# Altium schematic sheet ADC.SchDoc
size A4; SheetNumber: 7; SheetTotal: 9
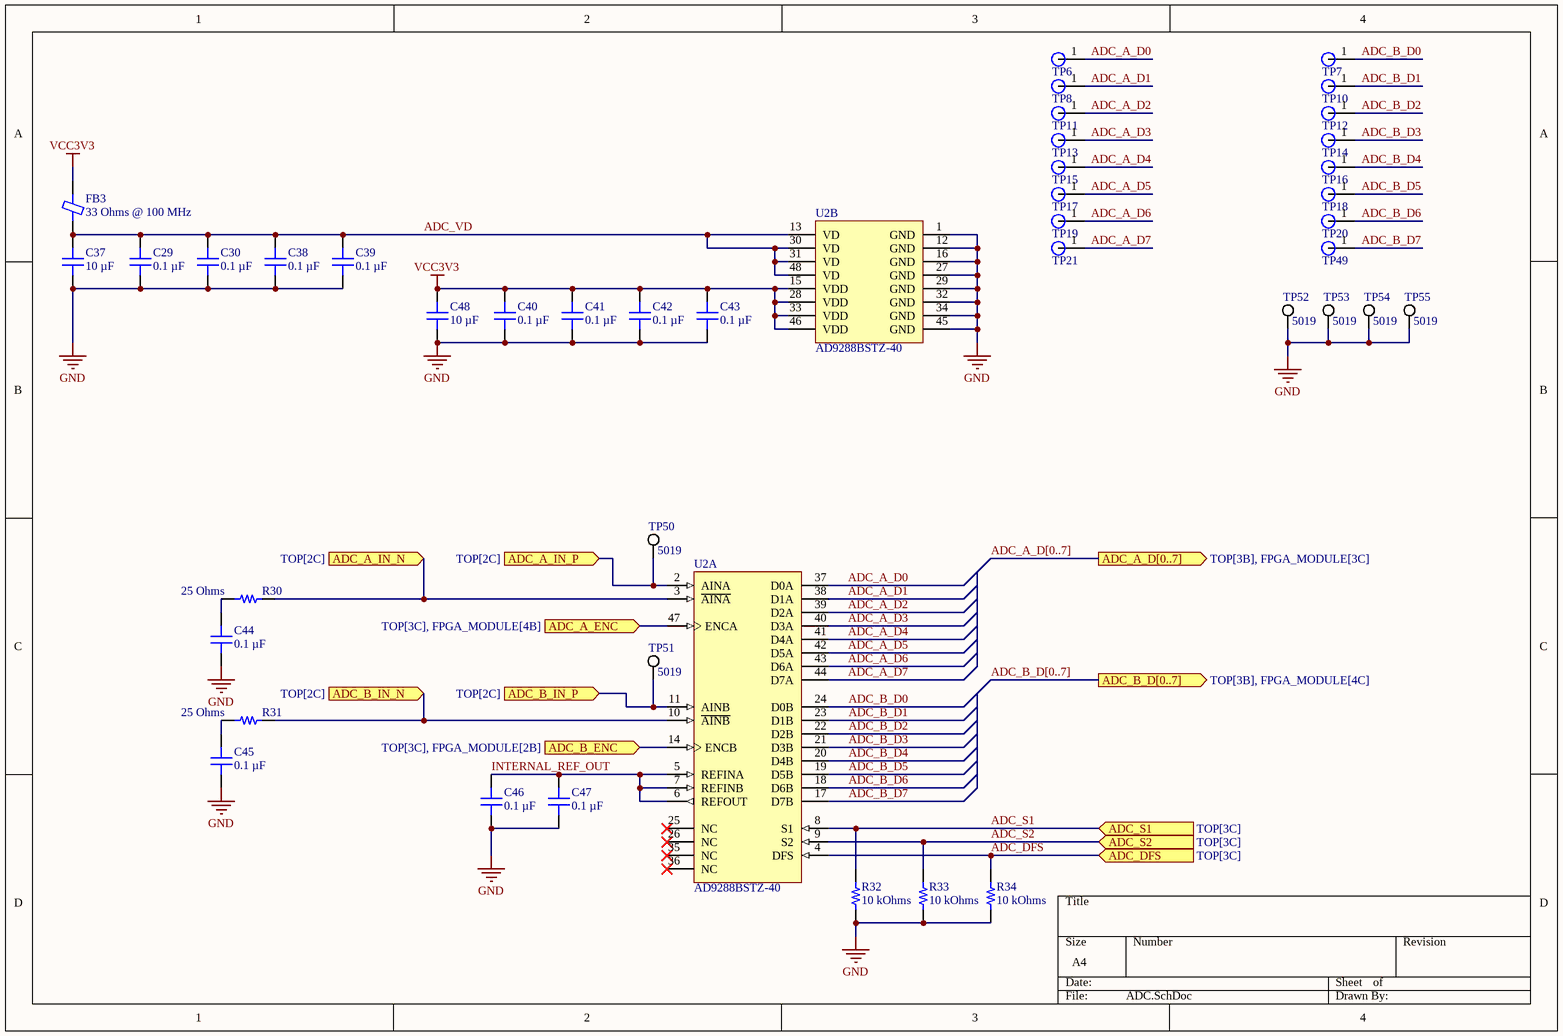
[diagram p0: ADC.SchDoc]

## Parts
C29  0.1 µF  [CAP 0402_1005]
C30  0.1 µF  [CAP 0402_1005]
C37  10 µF  [CAP 0402_1005]
C38  0.1 µF  [CAP 0402_1005]
C39  0.1 µF  [CAP 0402_1005]
C40  0.1 µF  [CAP 0402_1005]
C41  0.1 µF  [CAP 0402_1005]
C42  0.1 µF  [CAP 0402_1005]
C43  0.1 µF  [CAP 0402_1005]
C44  0.1 µF  [CAP 0402_1005]
C45  0.1 µF  [CAP 0402_1005]
C46  0.1 µF  [CAP 0402_1005]
C47  0.1 µF  [CAP 0402_1005]
C48  10 µF  [CAP 0402_1005]
FB3  33 Ohms @ 100 MHz  [FER 0201_0603]
R30  25 Ohms  [RES 0402_1005]
R31  25 Ohms  [RES 0402_1005]
R32  10 kOhms  [RES 0402_1005]
R33  10 kOhms  [RES 0402_1005]
R34  10 kOhms  [RES 0402_1005]
TP6  Test Point  [TP1]  (value not drawn)  (no BOM)
TP7  Test Point  [TP1]  (value not drawn)  (no BOM)
TP8  Test Point  [TP1]  (value not drawn)  (no BOM)
TP10  Test Point  [TP1]  (value not drawn)  (no BOM)
TP11  Test Point  [TP1]  (value not drawn)  (no BOM)
TP12  Test Point  [TP1]  (value not drawn)  (no BOM)
TP13  Test Point  [TP1]  (value not drawn)  (no BOM)
TP14  Test Point  [TP1]  (value not drawn)  (no BOM)
TP15  Test Point  [TP1]  (value not drawn)  (no BOM)
TP16  Test Point  [TP1]  (value not drawn)  (no BOM)
TP17  Test Point  [TP1]  (value not drawn)  (no BOM)
TP18  Test Point  [TP1]  (value not drawn)  (no BOM)
TP19  Test Point  [TP1]  (value not drawn)  (no BOM)
TP20  Test Point  [TP1]  (value not drawn)  (no BOM)
TP21  Test Point  [TP1]  (value not drawn)  (no BOM)
TP49  Test Point  [TP1]  (value not drawn)  (no BOM)
TP50  5019  [KSTN-5019_V]
TP51  5019  [KSTN-5019_V]
TP52  5019  [KSTN-5019_V]
TP53  5019  [KSTN-5019_V]
TP54  5019  [KSTN-5019_V]
TP55  5019  [KSTN-5019_V]
U2  AD9288BSTZ-40  [ST-48_M]  (parts A,B of 2)

## Ports
ADC_A_D[0..7] (out, see TOP[3B], FPGA_MODULE[3C]), ADC_A_ENC (in, see TOP[3C], FPGA_MODULE[4B]), ADC_A_IN_N (in, see TOP[2C]), ADC_A_IN_P (in, see TOP[2C]), ADC_B_D[0..7] (out, see TOP[3B], FPGA_MODULE[4C]), ADC_B_ENC (in, see TOP[3C], FPGA_MODULE[2B]), ADC_B_IN_N (in, see TOP[2C]), ADC_B_IN_P (in, see TOP[2C]), ADC_DFS (in, see TOP[3C]), ADC_S1 (in, see TOP[3C]), ADC_S2 (in, see TOP[3C])

## Nets
GND: C29.1 C30.1 C37.1 C38.1 C39.1 C40.1 C41.1 C42.1 C43.1 C44.1 C45.1 C46.1 C47.1 C48.1 R32.1 R33.1 R34.1 TP52.1 TP53.1 TP54.1 TP55.1 U2.1(GND) U2.12(GND) U2.16(GND) U2.27(GND) U2.29(GND) U2.32(GND) U2.34(GND) U2.45(GND)
VCC3V3: C40.2 C41.2 C42.2 C43.2 C48.2 FB3.1 U2.15(VDD) U2.28(VDD) U2.33(VDD) U2.46(VDD)
ADC_A_D0: TP6.1 U2.37(D0A)
ADC_A_D1: TP8.1 U2.38(D1A)
ADC_A_D2: TP11.1 U2.39(D2A)
ADC_A_D3: TP13.1 U2.40(D3A)
ADC_A_D4: TP15.1 U2.41(D4A)
ADC_A_D5: TP17.1 U2.42(D5A)
ADC_A_D6: TP19.1 U2.43(D6A)
ADC_A_D7: TP21.1 U2.44(D7A)
ADC_A_ENC: U2.47(ENCA) ; port ADC_A_ENC
ADC_A_IN_N: R30.2 U2.3(~{AINA}) ; port ADC_A_IN_N
ADC_A_IN_P: TP50.1 U2.2(AINA) ; port ADC_A_IN_P
ADC_B_D0: TP7.1 U2.24(D0B)
ADC_B_D1: TP10.1 U2.23(D1B)
ADC_B_D2: TP12.1 U2.22(D2B)
ADC_B_D3: TP14.1 U2.21(D3B)
ADC_B_D4: TP16.1 U2.20(D4B)
ADC_B_D5: TP18.1 U2.19(D5B)
ADC_B_D6: TP20.1 U2.18(D6B)
ADC_B_D7: TP49.1 U2.17(D7B)
ADC_B_ENC: U2.14(ENCB) ; port ADC_B_ENC
ADC_B_IN_N: R31.2 U2.10(~{AINB}) ; port ADC_B_IN_N
ADC_B_IN_P: TP51.1 U2.11(AINB) ; port ADC_B_IN_P
ADC_DFS: R34.2 U2.4(DFS) ; port ADC_DFS
ADC_S1: R32.2 U2.8(S1) ; port ADC_S1
ADC_S2: R33.2 U2.9(S2) ; port ADC_S2
ADC_VD: C29.2 C30.2 C37.2 C38.2 C39.2 FB3.2 U2.13(VD) U2.30(VD) U2.31(VD) U2.48(VD)
INTERNAL_REF_OUT: C46.2 C47.2 U2.5(REFINA) U2.6(REFOUT) U2.7(REFINB)
NetC44_2: C44.2 R30.1
NetC45_2: C45.2 R31.1

Not connected (* = marked no-connect by the designer): U2 25(NC)* 26(NC)* 35(NC)* 36(NC)*

## Buses and harness runs
bus ADC_A_D[0..7] = port ADC_A_D[0..7]
bus ADC_B_D[0..7] = port ADC_B_D[0..7]

## Library data of the parts
C29 C30 C38-C47 = CGA2B3X5R1H104M050BB: CAP CER 0.1UF 50V X5R 0402; manufacturer: TDK Corporation; Tolerance: ±20%; Part Number: CGA2B3X5R1H104M050BB; Value: 0.1 µF; Applications: Automotive; Capacitance: 0.1 µF; componentlink1description: Datasheet; componentlink1url: https://product.tdk.com/info/en/catalog/datasheets/mlcc_automotive_general_en.pdf?ref_disty=digikey; componentlink2description: DigiKey Link; componentlink2url: https://www.digikey.com/en/products/detail/tdk-corporation/CGA2B3X5R1H104M050BB/3949450; Device Package: 0402 (1005 Metric); lastupdated: 2022-07-21 3:55:54 AM; Lifecycle Status: Active; Minimum Order: 1; Mounting Type: Surface Mount, MLCC; Operating Temperature: -55°C ~ 85°C; Package / Case: 0402 (1005 Metric); packaging: TapeAndReel; partid: 1792; Part Status: Active; price: 0.02; Ratings: AEC-Q200; series: CGA; Size / Dimension: 0.039" L x 0.020" W (1.00mm x 0.50mm); Supplier 1: DigiKey; Supplier Part Number 1: 445-12214-1-ND; Temperature Coefficient: X5R; Thickness (Max): 0.022" (0.55mm); Voltage - Rated: 50V
C37 C48 = CL05A106MP8NUB8: CAP CER 10UF 10V X5R 0402; manufacturer: Samsung Electro-Mechanics; Tolerance: ±20%; Part Number: CL05A106MP8NUB8; Value: 10 µF; Applications: General Purpose; Capacitance: 10 µF; componentlink1description: Datasheet; componentlink1url: http://www.samsungsem.com/kr/support/product-search/mlcc/CL05A106MP8NUB8.jsp; componentlink2description: DigiKey Link; componentlink2url: https://www.digikey.com/en/products/detail/samsung-electro-mechanics/CL05A106MP8NUB8/5961314; Device Package: 0402 (1005 Metric); lastupdated: 2022-07-15 11:25:56 AM; Lifecycle Status: Active; Minimum Order: 1; Mounting Type: Surface Mount, MLCC; Operating Temperature: -55°C ~ 85°C; Package / Case: 0402 (1005 Metric); packaging: TapeAndReel; partid: 1758; Part Status: Active; price: 0.07; series: CL; Size / Dimension: 0.039" L x 0.020" W (1.00mm x 0.50mm); Supplier 1: DigiKey; Supplier Part Number 1: 1276-6830-1-ND; Temperature Coefficient: X5R; Thickness (Max): 0.035" (0.90mm); Voltage - Rated: 10V
FB3 = MMZ0603F330CT000: FERRITE BEAD 33 OHM 0201 1LN; Manufacturer: TDK Corporation; Current Rating (Max): 150mA; DC Resistance (DCR) (Max): 1.3Ohm; Filter Type: Signal Line; Number of Lines: 1; Part Number: MMZ0603F330CT000; ComponentLink1Description: Datasheet; ComponentLink1URL: https://product.tdk.com/info/en/catalog/datasheets/beads_commercial_signal_mmz0603_en.pdf?ref_disty=digikey; ComponentLink2Description: DigiKey Link; ComponentLink2URL: https://www.digikey.com/en/products/detail/tdk-corporation/MMZ0603F330CT000/2747662; Device Package: 0201 (0603 Metric); Height (Max): 0.013" (0.33mm); Impedance @ Frequency: 33 Ohms @ 100 MHz; LastUpdated: 2022-07-21 4:37:41 AM; Lifecycle Status: Active; Minimum Order: 1; Mounting Type: Surface Mount; Operating Temperature: -55°C ~ 125°C; Package / Case: 0201 (0603 Metric); Packaging: TapeAndReel; PartId: 1; Part Status: Active; Price: 0.03; Series: MMZ; Size / Dimension: 0.024" L x 0.012" W (0.60mm x 0.30mm); Supplier 1: DigiKey; Supplier Part Number 1: 445-7792-1-ND; Value: 33 Ohms @ 100 MHz
R30 R31 = FC0402E25R0BST0: RES 25 OHM 0.1% 1/20W 0402; Manufacturer: Vishay Thin Film; Power (Watts): 0.05W, 1/20W; Temperature Coefficient: ±25ppm/°C; Part Number: FC0402E25R0BST0; Value: 25 Ohms; ComponentLink1Description: Datasheet; ComponentLink1URL: http://www.vishay.com/docs/60093/fcseries.pdf; ComponentLink2Description: DigiKey Link; ComponentLink2URL: http://digikey.com/product-detail/en/vishay-thin-film/FC0402E25R0BST0/764-1327-1-ND/7103111; Composition: Thin Film; Device Package: 0402 (1005 Metric); Features: RF, High Frequency; Height - Seated (Max): 0.015" (0.38mm); LastUpdated: 2022-09-18 12:21:41 PM; Lifecycle Status: Active; Minimum Order: 1; Number of Terminations: 2; Operating Temperature: -55°C ~ 155°C; Package / Case: 0402 (1005 Metric); Packaging: TapeAndReel; PartId: 11457; Part Status: Active; Price: 2.00; Resistance: 25 Ohms; Series: FC; Size / Dimension: 0.042" L x 0.022" W (1.07mm x 0.56mm); Supplier 1: DigiKey; Supplier Part Number 1: 764-1327-1-ND; Supplier Device Package: 0402; Tolerance: ±0.1%
R32-R34 = RP73PF1E10KBTD: RES 10K OHM 0.1% 1/10W 0402; Manufacturer: TE Connectivity Passive Product; Power (Watts): 0.1W, 1/10W; Temperature Coefficient: ±25ppm/°C; Part Number: RP73PF1E10KBTD; Value: 10 kOhms; ComponentLink1Description: Datasheet; ComponentLink1URL: https://www.te.com/commerce/DocumentDelivery/DDEController?Action=srchrtrv&DocNm=1773272&DocType=DS&DocLang=English; ComponentLink2Description: DigiKey Link; ComponentLink2URL: https://www.digikey.com/en/products/detail/te-connectivity-passive-product/RP73PF1E10KBTD/8260957; Composition: Thin Film; Device Package: 0402 (1005 Metric); Height - Seated (Max): 0.014" (0.35mm); LastUpdated: 2022-07-15 11:43:14 AM; Lifecycle Status: Active; Minimum Order: 1; Number of Terminations: 2; Operating Temperature: -55°C ~ 155°C; Package / Case: 0402 (1005 Metric); Packaging: TapeAndReel; PartId: 2434; Part Status: Active; Price: 0.09; Resistance: 10 kOhms; Series: RP73, Holsworthy; Size / Dimension: 0.039" L x 0.020" W (1.00mm x 0.50mm); Supplier 1: DigiKey; Supplier Part Number 1: A127415CT-ND; Supplier Device Package: 0402; Tolerance: ±0.1%
TP6-TP8 TP10-TP21 TP49 = TP1
TP50-TP55 = CMP-1672-00008-1: Test Point, 1 Position SMD, RoHS, Tape and Reel; ComponentLink1Description: Manufacturer URL; Package Quantity: 1000; DatasheetVersion: 03/2014; Packaging: Tape and Reel; ComponentLink2URL: http://www.keyelco.com/product-pdf.cfm?p=1357; ComponentLink1URL: http://www.keyelco.com/; Mount: Surface Mount; Contact Plating: Silver; PackageDescription: 1-Pin Surface Mount Device, Body 3.81 x 2.03 mm; Pins: 1; RoHSCompliant: True; Mounting Technology: Surface Mount; ComponentLink2Description: Datasheet; PackageReference: 5019
U2 = CMP-0313-02378-2: Dual 8-Bit Analog-to-Digital Converter with Parallel Interface, 40MSPS, -40 to +85 degC, ST-48, Pb-Free, Tray; Generic Part Number: AD9288-40; Manufacturer: Analog Devices; Resolution (Bits): 8; Channels: 2; Interface: Par; Throughput Rate (SPS): 40M; PackageReference: ST-48; ComponentLink1Description: Manufacturer URL; PackageVersion: revA; ComponentLink2Description: Datasheet; Mounting Technology: Surface Mount; RoHS: Y; Packing: Tray; PartNumber: AD9288BSTZ-40; ComponentLink3Description: Package Specification; DatasheetVersion: Rev.C; PackageDescription: 48-Pin Thin Quad Flat Pack 0.5 mm Pitch; ComponentLink2URL: http://www.analog.com/static/imported-files/data_sheets/AD9288.pdf; ComponentLink3URL: http://www.analog.com/static/imported-files/packages/PKG_PDF/LQFP%28ST%29/ST_48.pdf; ComponentLink4URL: http://www.analog.com/en/analog-to-digital-converters/ad-converters/ad9288/products/product.html; ComponentLink1URL: http://www.analog.com/en/index.html; ComponentLink4Description: Product URL